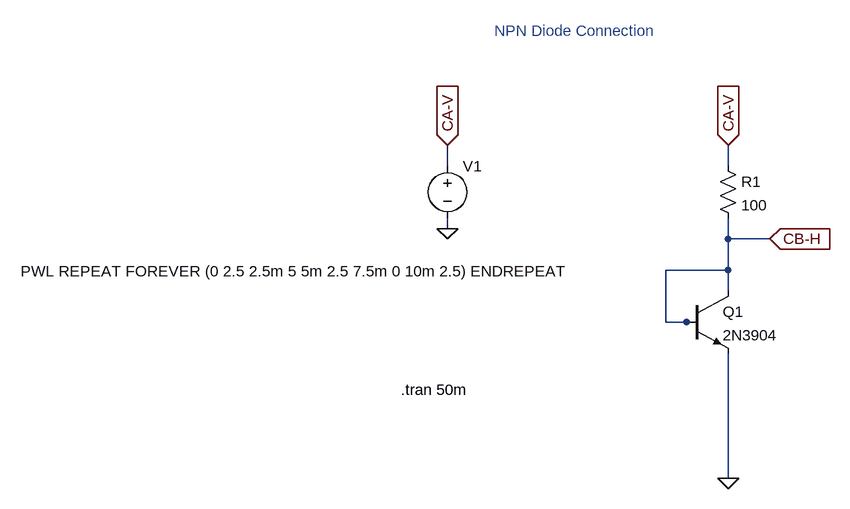
[diagram p0: schematic npn_diode_conn_ltspice.asc]
npn_diode_conn_ltspice.asc, the LTspice schematic file:
Version 4
SHEET 1 880 680
WIRE -192 -64 -192 -96
WIRE 240 -64 240 -96
WIRE -192 32 -192 16
WIRE 240 48 240 16
WIRE 304 48 240 48
WIRE 240 96 240 48
WIRE 240 96 144 96
WIRE 240 128 240 96
WIRE 144 176 144 96
WIRE 176 176 144 176
WIRE 192 176 176 176
WIRE 240 416 240 224
FLAG 240 -96 CA-V
IOPIN 240 -96 In
FLAG 304 48 CB-H
IOPIN 304 48 In
FLAG -192 32 0
FLAG -192 -96 CA-V
IOPIN -192 -96 In
FLAG 240 416 0
SYMBOL res 224 -80 R0
SYMATTR InstName R1
SYMATTR Value 100
SYMBOL voltage -192 -80 R0
WINDOW 3 -657 178 Left 2
WINDOW 123 0 0 Left 0
WINDOW 39 0 0 Left 0
SYMATTR Value PWL REPEAT FOREVER (0 2.5 2.5m 5 5m 2.5 7.5m 0 10m 2.5) ENDREPEAT
SYMATTR InstName V1
SYMBOL npn 176 128 R0
SYMATTR InstName Q1
SYMATTR Value 2N3904
TEXT -264 280 Left 2 !.tran 50m
TEXT -120 -272 Left 2 ;NPN Diode Connection

The netlist it stands for:
* npn_diode_conn_ltspice.asc
R1 CA-V CB-H 100
V1 CA-V 0 PWL REPEAT FOREVER (0 2.5 2.5m 5 5m 2.5 7.5m 0 10m 2.5) ENDREPEAT
Q1 CB-H CB-H 0 0 2N3904
.model NPN NPN
.model PNP PNP
.lib standard.bjt
.tran 50m
* NPN Diode Connection
.backanno
.end